# Altium schematic sheet AFE.SchDoc: FIT_PM12 board
size 420 x 297 mm; CheckedBy: G.Kasprowicz; Author: INR Moscow; CompanyName: WUT ISE; DrawnBy: M.Podgórski; Organization: WUT ISE; Address1: PW ISE; Address2: Nowowiejska 15/19 00-665 Warsaw; Address3: gkasprow@gmail.com; DocumentNumber: 2; Revision: 2; SheetNumber: 4; SheetTotal: 21; ModifiedBy: -; CheckedDate: -; Title2: AFEs; DivGrp: WUT ISE; Designer: INR RAS; ModifiedDate: -; ProjectName: Sensor Box
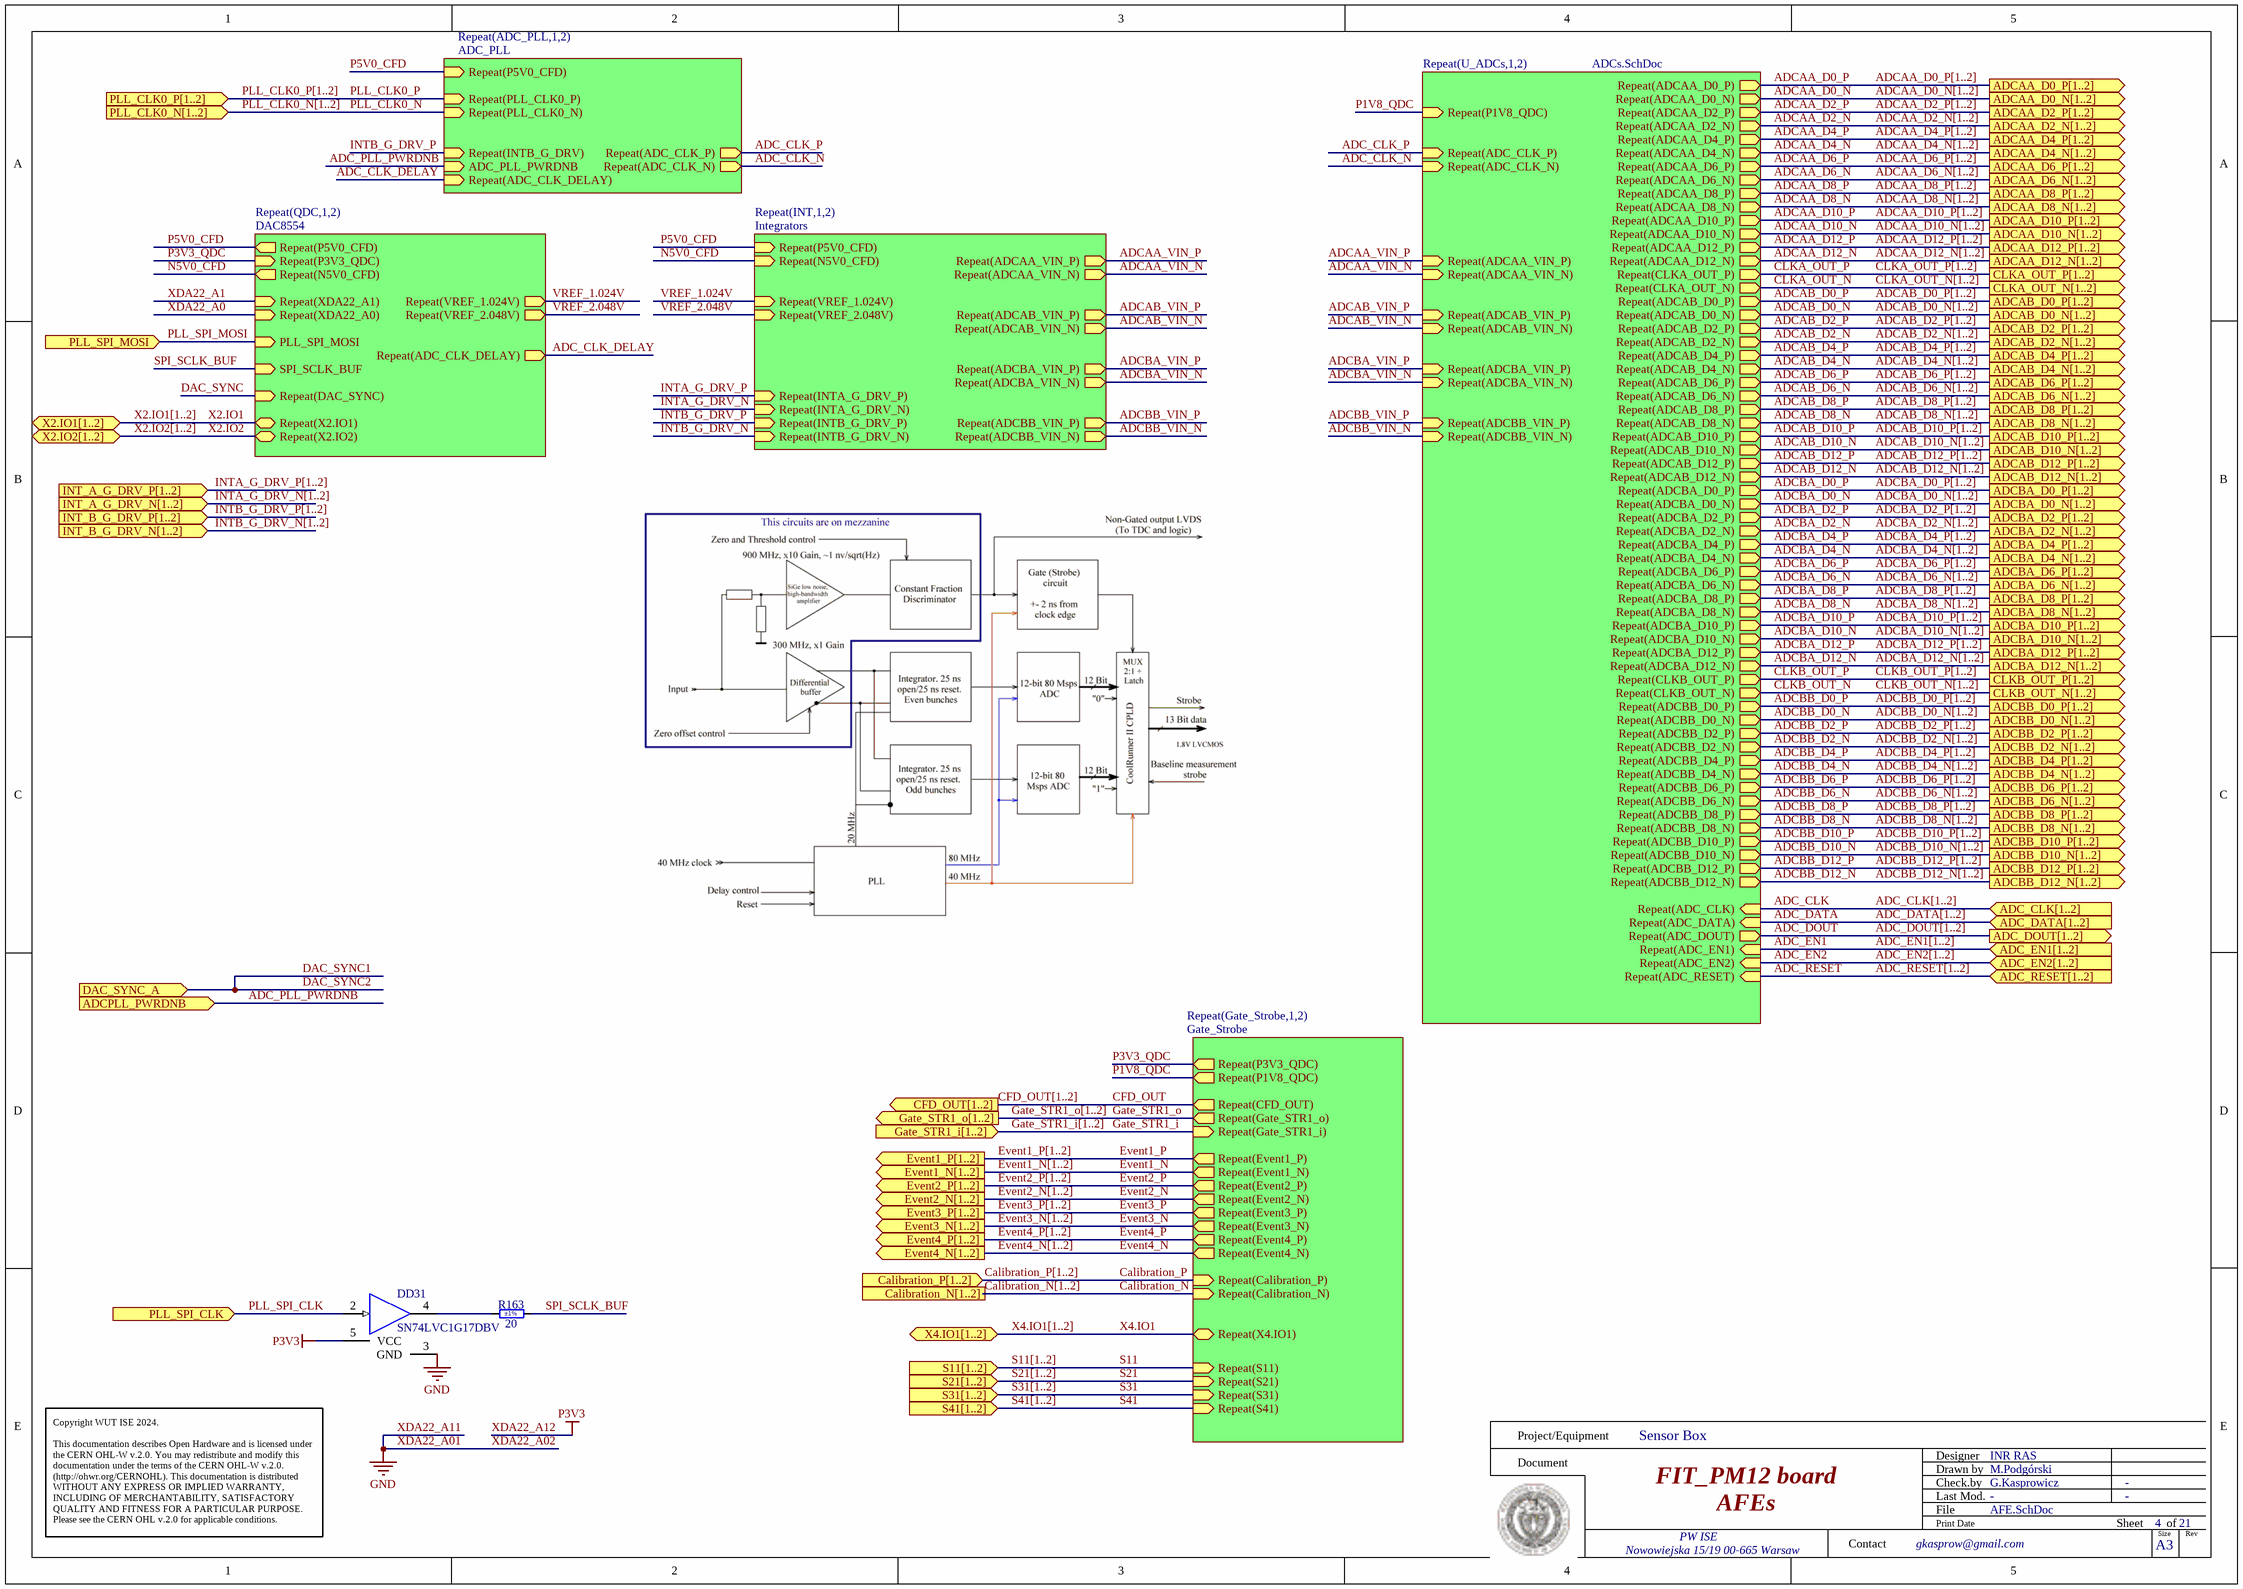
[diagram p0: AFE.SchDoc]

## Parts
DD31  SN74LVC1G17DBV  [SOT95P280X145-5N]
R163  20  Tolerance: ±1%  [RESC2012X60N]

## Sub-sheets
Repeat(ADC_PLL,1,2) = ADC_PLL: ADC_PLL_PWRDNB (in), Repeat(ADC_CLK_DELAY) (in), Repeat(P5V0_CFD) (in), Repeat(INTB_G_DRV) (in), Repeat(PLL_CLK0_P) (in), Repeat(PLL_CLK0_N) (in), Repeat(ADC_CLK_P) (out), Repeat(ADC_CLK_N) (out)
Repeat(Gate_Strobe,1,2) = Gate_Strobe: Repeat(Gate_STR1_i) (in), Repeat(Event1_P) (out), Repeat(Event1_N) (out), Repeat(P3V3_QDC) (out), Repeat(Gate_STR1_o) (out), Repeat(CFD_OUT) (out), Repeat(P1V8_QDC) (out), Repeat(X4.IO1) (bidir), Repeat(Event2_P) (out), Repeat(Event2_N) (out), Repeat(Event3_P) (out), Repeat(Event3_N) (out), Repeat(Event4_P) (out), Repeat(Event4_N) (out), Repeat(Calibration_P) (in), Repeat(Calibration_N) (in), Repeat(S11) (in), Repeat(S21) (in), Repeat(S31) (in), Repeat(S41) (in)
Repeat(INT,1,2) = Integrators: Repeat(N5V0_CFD) (in), Repeat(P5V0_CFD) (in), Repeat(INTA_G_DRV_N) (in), Repeat(INTB_G_DRV_P) (in), Repeat(VREF_2.048V) (in), Repeat(VREF_1.024V) (in), Repeat(ADCAA_VIN_P) (out), Repeat(ADCAA_VIN_N) (out), Repeat(ADCAB_VIN_P) (out), Repeat(ADCAB_VIN_N) (out), Repeat(ADCBA_VIN_P) (out), Repeat(ADCBA_VIN_N) (out), Repeat(ADCBB_VIN_P) (out), Repeat(ADCBB_VIN_N) (out), Repeat(INTB_G_DRV_N) (in), Repeat(INTA_G_DRV_P) (in)
Repeat(QDC,1,2) = DAC8554: Repeat(ADC_CLK_DELAY) (out), PLL_SPI_MOSI (in), SPI_SCLK_BUF (in), Repeat(DAC_SYNC) (in), Repeat(P5V0_CFD) (out), Repeat(N5V0_CFD) (out), Repeat(P3V3_QDC) (in), Repeat(VREF_2.048V) (out), Repeat(VREF_1.024V) (out), Repeat(XDA22_A1) (in), Repeat(XDA22_A0) (in), Repeat(X2.IO1) (bidir), Repeat(X2.IO2) (bidir)
Repeat(U_ADCs,1,2) = ADCs.SchDoc: Repeat(ADCAA_VIN_P) (in), Repeat(ADCAA_VIN_N) (in), Repeat(ADCAB_VIN_P) (in), Repeat(ADCAB_VIN_N) (in), Repeat(ADCBA_VIN_P) (in), Repeat(ADCBA_VIN_N) (in), Repeat(ADCBB_VIN_P) (in), Repeat(ADCBB_VIN_N) (in), Repeat(P1V8_QDC) (in), Repeat(ADCAA_D0_P) (out), Repeat(ADCAA_D0_N) (out), Repeat(ADCAA_D2_P) (out), Repeat(ADCAA_D2_N) (out), Repeat(ADCAA_D4_P) (out), Repeat(ADCAA_D4_N) (out), Repeat(ADCAA_D6_P) (out), Repeat(ADCAA_D6_N) (out), Repeat(ADCAA_D8_P) (out), Repeat(ADCAA_D8_N) (out), Repeat(ADCAA_D10_P) (out), Repeat(ADCAA_D10_N) (out), Repeat(ADCAA_D12_P) (out), Repeat(ADCAA_D12_N) (out), Repeat(CLKA_OUT_P) (out), Repeat(CLKA_OUT_N) (out), Repeat(ADCAB_D0_P) (out), Repeat(ADCAB_D0_N) (out), Repeat(ADCAB_D2_P) (out), Repeat(ADCAB_D2_N) (out), Repeat(ADCAB_D4_P) (out), Repeat(ADCAB_D4_N) (out), Repeat(ADCAB_D6_P) (out), Repeat(ADCAB_D6_N) (out), Repeat(ADCAB_D8_P) (out), Repeat(ADCAB_D8_N) (out), Repeat(ADCAB_D10_P) (out), Repeat(ADCAB_D10_N) (out), Repeat(ADCAB_D12_P) (out), Repeat(ADCAB_D12_N) (out), Repeat(ADCBA_D0_P) (out), Repeat(ADCBA_D0_N) (out), Repeat(ADCBA_D2_P) (out), Repeat(ADCBA_D2_N) (out), Repeat(ADCBA_D4_P) (out), Repeat(ADCBA_D4_N) (out), Repeat(ADCBA_D6_P) (out), Repeat(ADCBA_D6_N) (out), Repeat(ADCBA_D8_P) (out), Repeat(ADCBA_D8_N) (out), Repeat(ADCBA_D10_P) (out), Repeat(ADCBA_D10_N) (out), Repeat(ADCBA_D12_P) (out), Repeat(ADCBA_D12_N) (out), Repeat(CLKB_OUT_P) (out), Repeat(CLKB_OUT_N) (out), Repeat(ADCBB_D0_P) (out), Repeat(ADCBB_D0_N) (out), Repeat(ADCBB_D2_P) (out), Repeat(ADCBB_D2_N) (out), Repeat(ADCBB_D4_P) (out), Repeat(ADCBB_D4_N) (out), Repeat(ADCBB_D6_P) (out), Repeat(ADCBB_D6_N) (out), Repeat(ADCBB_D8_P) (out), Repeat(ADCBB_D8_N) (out), Repeat(ADCBB_D10_P) (out), Repeat(ADCBB_D10_N) (out), Repeat(ADCBB_D12_P) (out), Repeat(ADCBB_D12_N) (out), Repeat(ADC_CLK_N) (in), Repeat(ADC_CLK_P) (in), Repeat(ADC_CLK) (in), Repeat(ADC_DATA) (in), Repeat(ADC_DOUT) (out), Repeat(ADC_EN1) (in), Repeat(ADC_EN2) (in), Repeat(ADC_RESET) (in)

## Ports
ADC_CLK[1..2] (in), ADC_DATA[1..2] (in), ADC_DOUT[1..2] (out), ADC_EN1[1..2] (in), ADC_EN2[1..2] (in), ADC_RESET[1..2] (in), ADCAA_D0_N[1..2] (out), ADCAA_D0_P[1..2] (out), ADCAA_D2_N[1..2] (out), ADCAA_D2_P[1..2] (out), ADCAA_D4_N[1..2] (out), ADCAA_D4_P[1..2] (out), ADCAA_D6_N[1..2] (out), ADCAA_D6_P[1..2] (out), ADCAA_D8_N[1..2] (out), ADCAA_D8_P[1..2] (out), ADCAA_D10_N[1..2] (out), ADCAA_D10_P[1..2] (out), ADCAA_D12_N[1..2] (out), ADCAA_D12_P[1..2] (out), ADCAB_D0_N[1..2] (out), ADCAB_D0_P[1..2] (out), ADCAB_D2_N[1..2] (out), ADCAB_D2_P[1..2] (out), ADCAB_D4_N[1..2] (out), ADCAB_D4_P[1..2] (out), ADCAB_D6_N[1..2] (out), ADCAB_D6_P[1..2] (out), ADCAB_D8_N[1..2] (out), ADCAB_D8_P[1..2] (out), ADCAB_D10_N[1..2] (out), ADCAB_D10_P[1..2] (out), ADCAB_D12_N[1..2] (out), ADCAB_D12_P[1..2] (out), ADCBA_D0_N[1..2] (out), ADCBA_D0_P[1..2] (out), ADCBA_D2_N[1..2] (out), ADCBA_D2_P[1..2] (out), ADCBA_D4_N[1..2] (out), ADCBA_D4_P[1..2] (out), ADCBA_D6_N[1..2] (out), ADCBA_D6_P[1..2] (out), ADCBA_D8_N[1..2] (out), ADCBA_D8_P[1..2] (out), ADCBA_D10_N[1..2] (out), ADCBA_D10_P[1..2] (out), ADCBA_D12_N[1..2] (out), ADCBA_D12_P[1..2] (out), ADCBB_D0_N[1..2] (out), ADCBB_D0_P[1..2] (out), ADCBB_D2_N[1..2] (out), ADCBB_D2_P[1..2] (out), ADCBB_D4_N[1..2] (out), ADCBB_D4_P[1..2] (out), ADCBB_D6_N[1..2] (out), ADCBB_D6_P[1..2] (out), ADCBB_D8_N[1..2] (out), ADCBB_D8_P[1..2] (out), ADCBB_D10_N[1..2] (out), ADCBB_D10_P[1..2] (out), ADCBB_D12_N[1..2] (out), ADCBB_D12_P[1..2] (out), ADCPLL_PWRDNB (in), Calibration_N[1..2] (in), Calibration_P[1..2] (in), CFD_OUT[1..2] (out), CLKA_OUT_N[1..2] (out), CLKA_OUT_P[1..2] (out), CLKB_OUT_N[1..2] (out), CLKB_OUT_P[1..2] (out), DAC_SYNC_A (in), Event1_N[1..2] (out), Event1_P[1..2] (out), Event2_N[1..2] (out), Event2_P[1..2] (out), Event3_N[1..2] (out), Event3_P[1..2] (out), Event4_N[1..2] (out), Event4_P[1..2] (out), Gate_STR1_i[1..2] (in), Gate_STR1_o[1..2] (out), INT_A_G_DRV_N[1..2] (in), INT_A_G_DRV_P[1..2] (in), INT_B_G_DRV_N[1..2] (in), INT_B_G_DRV_P[1..2] (in), PLL_CLK0_N[1..2] (in), PLL_CLK0_P[1..2] (in), PLL_SPI_CLK (in), PLL_SPI_MOSI (in), S11[1..2] (in), S21[1..2] (in), S31[1..2] (in), S41[1..2] (in), X2.IO1[1..2] (bidir), X2.IO2[1..2] (bidir), X4.IO1[1..2] (bidir)

## Nets
XDA22_A01: DD31.3(GND)  [also labelled GND, XDA22_A02, XDA22_A11]
XDA22_A12: DD31.5(VCC)  [also labelled P3V3]
ADC_CLK: sheet Repeat(U_ADCs,1,2)/Repeat(ADC_CLK)
ADC_CLK_DELAY: sheet Repeat(QDC,1,2)/Repeat(ADC_CLK_DELAY), sheet Repeat(ADC_PLL,1,2)/Repeat(ADC_CLK_DELAY)
ADC_CLK_N: sheet Repeat(ADC_PLL,1,2)/Repeat(ADC_CLK_N), sheet Repeat(U_ADCs,1,2)/Repeat(ADC_CLK_N)
ADC_CLK_P: sheet Repeat(ADC_PLL,1,2)/Repeat(ADC_CLK_P), sheet Repeat(U_ADCs,1,2)/Repeat(ADC_CLK_P)
ADC_DATA: sheet Repeat(U_ADCs,1,2)/Repeat(ADC_DATA)
ADC_DOUT: sheet Repeat(U_ADCs,1,2)/Repeat(ADC_DOUT)
ADC_EN1: sheet Repeat(U_ADCs,1,2)/Repeat(ADC_EN1)
ADC_EN2: sheet Repeat(U_ADCs,1,2)/Repeat(ADC_EN2)
ADC_PLL_PWRDNB: port ADCPLL_PWRDNB, sheet Repeat(ADC_PLL,1,2)/ADC_PLL_PWRDNB
ADC_RESET: sheet Repeat(U_ADCs,1,2)/Repeat(ADC_RESET)
ADCAA_D0_N: sheet Repeat(U_ADCs,1,2)/Repeat(ADCAA_D0_N)
ADCAA_D0_P: sheet Repeat(U_ADCs,1,2)/Repeat(ADCAA_D0_P)
ADCAA_D2_N: sheet Repeat(U_ADCs,1,2)/Repeat(ADCAA_D2_N)
ADCAA_D2_P: sheet Repeat(U_ADCs,1,2)/Repeat(ADCAA_D2_P)
ADCAA_D4_N: sheet Repeat(U_ADCs,1,2)/Repeat(ADCAA_D4_N)
ADCAA_D4_P: sheet Repeat(U_ADCs,1,2)/Repeat(ADCAA_D4_P)
ADCAA_D6_N: sheet Repeat(U_ADCs,1,2)/Repeat(ADCAA_D6_N)
ADCAA_D6_P: sheet Repeat(U_ADCs,1,2)/Repeat(ADCAA_D6_P)
ADCAA_D8_N: sheet Repeat(U_ADCs,1,2)/Repeat(ADCAA_D8_N)
ADCAA_D8_P: sheet Repeat(U_ADCs,1,2)/Repeat(ADCAA_D8_P)
ADCAA_D10_N: sheet Repeat(U_ADCs,1,2)/Repeat(ADCAA_D10_N)
ADCAA_D10_P: sheet Repeat(U_ADCs,1,2)/Repeat(ADCAA_D10_P)
ADCAA_D12_N: sheet Repeat(U_ADCs,1,2)/Repeat(ADCAA_D12_N)
ADCAA_D12_P: sheet Repeat(U_ADCs,1,2)/Repeat(ADCAA_D12_P)
ADCAA_VIN_N: sheet Repeat(INT,1,2)/Repeat(ADCAA_VIN_N), sheet Repeat(U_ADCs,1,2)/Repeat(ADCAA_VIN_N)
ADCAA_VIN_P: sheet Repeat(INT,1,2)/Repeat(ADCAA_VIN_P), sheet Repeat(U_ADCs,1,2)/Repeat(ADCAA_VIN_P)
ADCAB_D0_N: sheet Repeat(U_ADCs,1,2)/Repeat(ADCAB_D0_N)
ADCAB_D0_P: sheet Repeat(U_ADCs,1,2)/Repeat(ADCAB_D0_P)
ADCAB_D2_N: sheet Repeat(U_ADCs,1,2)/Repeat(ADCAB_D2_N)
ADCAB_D2_P: sheet Repeat(U_ADCs,1,2)/Repeat(ADCAB_D2_P)
ADCAB_D4_N: sheet Repeat(U_ADCs,1,2)/Repeat(ADCAB_D4_N)
ADCAB_D4_P: sheet Repeat(U_ADCs,1,2)/Repeat(ADCAB_D4_P)
ADCAB_D6_N: sheet Repeat(U_ADCs,1,2)/Repeat(ADCAB_D6_N)
ADCAB_D6_P: sheet Repeat(U_ADCs,1,2)/Repeat(ADCAB_D6_P)
ADCAB_D8_N: sheet Repeat(U_ADCs,1,2)/Repeat(ADCAB_D8_N)
ADCAB_D8_P: sheet Repeat(U_ADCs,1,2)/Repeat(ADCAB_D8_P)
ADCAB_D10_N: sheet Repeat(U_ADCs,1,2)/Repeat(ADCAB_D10_N)
ADCAB_D10_P: sheet Repeat(U_ADCs,1,2)/Repeat(ADCAB_D10_P)
ADCAB_D12_N: sheet Repeat(U_ADCs,1,2)/Repeat(ADCAB_D12_N)
ADCAB_D12_P: sheet Repeat(U_ADCs,1,2)/Repeat(ADCAB_D12_P)
ADCAB_VIN_N: sheet Repeat(INT,1,2)/Repeat(ADCAB_VIN_N), sheet Repeat(U_ADCs,1,2)/Repeat(ADCAB_VIN_N)
ADCAB_VIN_P: sheet Repeat(INT,1,2)/Repeat(ADCAB_VIN_P), sheet Repeat(U_ADCs,1,2)/Repeat(ADCAB_VIN_P)
ADCBA_D0_N: sheet Repeat(U_ADCs,1,2)/Repeat(ADCBA_D0_N)
ADCBA_D0_P: sheet Repeat(U_ADCs,1,2)/Repeat(ADCBA_D0_P)
ADCBA_D2_N: sheet Repeat(U_ADCs,1,2)/Repeat(ADCBA_D2_N)
ADCBA_D2_P: sheet Repeat(U_ADCs,1,2)/Repeat(ADCBA_D2_P)
ADCBA_D4_N: sheet Repeat(U_ADCs,1,2)/Repeat(ADCBA_D4_N)
ADCBA_D4_P: sheet Repeat(U_ADCs,1,2)/Repeat(ADCBA_D4_P)
ADCBA_D6_N: sheet Repeat(U_ADCs,1,2)/Repeat(ADCBA_D6_N)
ADCBA_D6_P: sheet Repeat(U_ADCs,1,2)/Repeat(ADCBA_D6_P)
ADCBA_D8_N: sheet Repeat(U_ADCs,1,2)/Repeat(ADCBA_D8_N)
ADCBA_D8_P: sheet Repeat(U_ADCs,1,2)/Repeat(ADCBA_D8_P)
ADCBA_D10_N: sheet Repeat(U_ADCs,1,2)/Repeat(ADCBA_D10_N)
ADCBA_D10_P: sheet Repeat(U_ADCs,1,2)/Repeat(ADCBA_D10_P)
ADCBA_D12_N: sheet Repeat(U_ADCs,1,2)/Repeat(ADCBA_D12_N)
ADCBA_D12_P: sheet Repeat(U_ADCs,1,2)/Repeat(ADCBA_D12_P)
ADCBA_VIN_N: sheet Repeat(INT,1,2)/Repeat(ADCBA_VIN_N), sheet Repeat(U_ADCs,1,2)/Repeat(ADCBA_VIN_N)
ADCBA_VIN_P: sheet Repeat(INT,1,2)/Repeat(ADCBA_VIN_P), sheet Repeat(U_ADCs,1,2)/Repeat(ADCBA_VIN_P)
ADCBB_D0_N: sheet Repeat(U_ADCs,1,2)/Repeat(ADCBB_D0_N)
ADCBB_D0_P: sheet Repeat(U_ADCs,1,2)/Repeat(ADCBB_D0_P)
ADCBB_D2_N: sheet Repeat(U_ADCs,1,2)/Repeat(ADCBB_D2_N)
ADCBB_D2_P: sheet Repeat(U_ADCs,1,2)/Repeat(ADCBB_D2_P)
ADCBB_D4_N: sheet Repeat(U_ADCs,1,2)/Repeat(ADCBB_D4_N)
ADCBB_D4_P: sheet Repeat(U_ADCs,1,2)/Repeat(ADCBB_D4_P)
ADCBB_D6_N: sheet Repeat(U_ADCs,1,2)/Repeat(ADCBB_D6_N)
ADCBB_D6_P: sheet Repeat(U_ADCs,1,2)/Repeat(ADCBB_D6_P)
ADCBB_D8_N: sheet Repeat(U_ADCs,1,2)/Repeat(ADCBB_D8_N)
ADCBB_D8_P: sheet Repeat(U_ADCs,1,2)/Repeat(ADCBB_D8_P)
ADCBB_D10_N: sheet Repeat(U_ADCs,1,2)/Repeat(ADCBB_D10_N)
ADCBB_D10_P: sheet Repeat(U_ADCs,1,2)/Repeat(ADCBB_D10_P)
ADCBB_D12_N: sheet Repeat(U_ADCs,1,2)/Repeat(ADCBB_D12_N)
ADCBB_D12_P: sheet Repeat(U_ADCs,1,2)/Repeat(ADCBB_D12_P)
ADCBB_VIN_N: sheet Repeat(INT,1,2)/Repeat(ADCBB_VIN_N), sheet Repeat(U_ADCs,1,2)/Repeat(ADCBB_VIN_N)
ADCBB_VIN_P: sheet Repeat(INT,1,2)/Repeat(ADCBB_VIN_P), sheet Repeat(U_ADCs,1,2)/Repeat(ADCBB_VIN_P)
Calibration_N: sheet Repeat(Gate_Strobe,1,2)/Repeat(Calibration_N)
Calibration_P: sheet Repeat(Gate_Strobe,1,2)/Repeat(Calibration_P)
CFD_OUT: sheet Repeat(Gate_Strobe,1,2)/Repeat(CFD_OUT)
CLKA_OUT_N: sheet Repeat(U_ADCs,1,2)/Repeat(CLKA_OUT_N)
CLKA_OUT_P: sheet Repeat(U_ADCs,1,2)/Repeat(CLKA_OUT_P)
CLKB_OUT_N: sheet Repeat(U_ADCs,1,2)/Repeat(CLKB_OUT_N)
CLKB_OUT_P: sheet Repeat(U_ADCs,1,2)/Repeat(CLKB_OUT_P)
DAC_SYNC: sheet Repeat(QDC,1,2)/Repeat(DAC_SYNC)
DAC_SYNC1: port DAC_SYNC_A  [also labelled DAC_SYNC2]
Event1_N: sheet Repeat(Gate_Strobe,1,2)/Repeat(Event1_N)
Event1_P: sheet Repeat(Gate_Strobe,1,2)/Repeat(Event1_P)
Event2_N: sheet Repeat(Gate_Strobe,1,2)/Repeat(Event2_N)
Event2_P: sheet Repeat(Gate_Strobe,1,2)/Repeat(Event2_P)
Event3_N: sheet Repeat(Gate_Strobe,1,2)/Repeat(Event3_N)
Event3_P: sheet Repeat(Gate_Strobe,1,2)/Repeat(Event3_P)
Event4_N: sheet Repeat(Gate_Strobe,1,2)/Repeat(Event4_N)
Event4_P: sheet Repeat(Gate_Strobe,1,2)/Repeat(Event4_P)
Gate_STR1_i: sheet Repeat(Gate_Strobe,1,2)/Repeat(Gate_STR1_i)
Gate_STR1_o: sheet Repeat(Gate_Strobe,1,2)/Repeat(Gate_STR1_o)
INTA_G_DRV_N: sheet Repeat(INT,1,2)/Repeat(INTA_G_DRV_N)
INTA_G_DRV_P: sheet Repeat(INT,1,2)/Repeat(INTA_G_DRV_P)
INTB_G_DRV_N: sheet Repeat(INT,1,2)/Repeat(INTB_G_DRV_N)
INTB_G_DRV_P: sheet Repeat(INT,1,2)/Repeat(INTB_G_DRV_P), sheet Repeat(ADC_PLL,1,2)/Repeat(INTB_G_DRV)
N5V0_CFD: sheet Repeat(INT,1,2)/Repeat(N5V0_CFD), sheet Repeat(QDC,1,2)/Repeat(N5V0_CFD)
P1V8_QDC: sheet Repeat(Gate_Strobe,1,2)/Repeat(P1V8_QDC), sheet Repeat(U_ADCs,1,2)/Repeat(P1V8_QDC)
P3V3_QDC: sheet Repeat(QDC,1,2)/Repeat(P3V3_QDC), sheet Repeat(Gate_Strobe,1,2)/Repeat(P3V3_QDC)
P5V0_CFD: sheet Repeat(INT,1,2)/Repeat(P5V0_CFD), sheet Repeat(QDC,1,2)/Repeat(P5V0_CFD), sheet Repeat(ADC_PLL,1,2)/Repeat(P5V0_CFD)
PLL_CLK0_N: sheet Repeat(ADC_PLL,1,2)/Repeat(PLL_CLK0_N)
PLL_CLK0_P: sheet Repeat(ADC_PLL,1,2)/Repeat(PLL_CLK0_P)
PLL_SPI_CLK: DD31.2(IN) ; port PLL_SPI_CLK
PLL_SPI_MOSI: port PLL_SPI_MOSI, sheet Repeat(QDC,1,2)/PLL_SPI_MOSI
S11: sheet Repeat(Gate_Strobe,1,2)/Repeat(S11)
S21: sheet Repeat(Gate_Strobe,1,2)/Repeat(S21)
S31: sheet Repeat(Gate_Strobe,1,2)/Repeat(S31)
S41: sheet Repeat(Gate_Strobe,1,2)/Repeat(S41)
SPI_SCLK_BUF: R163.2 ; sheet Repeat(QDC,1,2)/SPI_SCLK_BUF
VREF_1.024V: sheet Repeat(INT,1,2)/Repeat(VREF_1.024V), sheet Repeat(QDC,1,2)/Repeat(VREF_1.024V)
VREF_2.048V: sheet Repeat(INT,1,2)/Repeat(VREF_2.048V), sheet Repeat(QDC,1,2)/Repeat(VREF_2.048V)
X2.IO1: sheet Repeat(QDC,1,2)/Repeat(X2.IO1)
X2.IO2: sheet Repeat(QDC,1,2)/Repeat(X2.IO2)
X4.IO1: sheet Repeat(Gate_Strobe,1,2)/Repeat(X4.IO1)
XDA22_A0: sheet Repeat(QDC,1,2)/Repeat(XDA22_A0)
XDA22_A1: sheet Repeat(QDC,1,2)/Repeat(XDA22_A1)
NetDD31_4: DD31.4(OUT) R163.1

## Buses and harness runs
bus ADC_CLK[1..2] = port ADC_CLK[1..2]
bus ADC_DATA[1..2] = port ADC_DATA[1..2]
bus ADC_DOUT[1..2] = port ADC_DOUT[1..2]
bus ADC_EN1[1..2] = port ADC_EN1[1..2]
bus ADC_EN2[1..2] = port ADC_EN2[1..2]
bus ADC_RESET[1..2] = port ADC_RESET[1..2]
bus ADCAA_D0_N[1..2] = port ADCAA_D0_N[1..2]
bus ADCAA_D0_P[1..2] = port ADCAA_D0_P[1..2]
bus ADCAA_D2_N[1..2] = port ADCAA_D2_N[1..2]
bus ADCAA_D2_P[1..2] = port ADCAA_D2_P[1..2]
bus ADCAA_D4_N[1..2] = port ADCAA_D4_N[1..2]
bus ADCAA_D4_P[1..2] = port ADCAA_D4_P[1..2]
bus ADCAA_D6_N[1..2] = port ADCAA_D6_N[1..2]
bus ADCAA_D6_P[1..2] = port ADCAA_D6_P[1..2]
bus ADCAA_D8_N[1..2] = port ADCAA_D8_N[1..2]
bus ADCAA_D8_P[1..2] = port ADCAA_D8_P[1..2]
bus ADCAA_D10_N[1..2] = port ADCAA_D10_N[1..2]
bus ADCAA_D10_P[1..2] = port ADCAA_D10_P[1..2]
bus ADCAA_D12_N[1..2] = port ADCAA_D12_N[1..2]
bus ADCAA_D12_P[1..2] = port ADCAA_D12_P[1..2]
bus ADCAB_D0_N[1..2] = port ADCAB_D0_N[1..2]
bus ADCAB_D0_P[1..2] = port ADCAB_D0_P[1..2]
bus ADCAB_D2_N[1..2] = port ADCAB_D2_N[1..2]
bus ADCAB_D2_P[1..2] = port ADCAB_D2_P[1..2]
bus ADCAB_D4_N[1..2] = port ADCAB_D4_N[1..2]
bus ADCAB_D4_P[1..2] = port ADCAB_D4_P[1..2]
bus ADCAB_D6_N[1..2] = port ADCAB_D6_N[1..2]
bus ADCAB_D6_P[1..2] = port ADCAB_D6_P[1..2]
bus ADCAB_D8_N[1..2] = port ADCAB_D8_N[1..2]
bus ADCAB_D8_P[1..2] = port ADCAB_D8_P[1..2]
bus ADCAB_D10_N[1..2] = port ADCAB_D10_N[1..2]
bus ADCAB_D10_P[1..2] = port ADCAB_D10_P[1..2]
bus ADCAB_D12_N[1..2] = port ADCAB_D12_N[1..2]
bus ADCAB_D12_P[1..2] = port ADCAB_D12_P[1..2]
bus ADCBA_D0_N[1..2] = port ADCBA_D0_N[1..2]
bus ADCBA_D0_P[1..2] = port ADCBA_D0_P[1..2]
bus ADCBA_D2_N[1..2] = port ADCBA_D2_N[1..2]
bus ADCBA_D2_P[1..2] = port ADCBA_D2_P[1..2]
bus ADCBA_D4_N[1..2] = port ADCBA_D4_N[1..2]
bus ADCBA_D4_P[1..2] = port ADCBA_D4_P[1..2]
bus ADCBA_D6_N[1..2] = port ADCBA_D6_N[1..2]
bus ADCBA_D6_P[1..2] = port ADCBA_D6_P[1..2]
bus ADCBA_D8_N[1..2] = port ADCBA_D8_N[1..2]
bus ADCBA_D8_P[1..2] = port ADCBA_D8_P[1..2]
bus ADCBA_D10_N[1..2] = port ADCBA_D10_N[1..2]
bus ADCBA_D10_P[1..2] = port ADCBA_D10_P[1..2]
bus ADCBA_D12_N[1..2] = port ADCBA_D12_N[1..2]
bus ADCBA_D12_P[1..2] = port ADCBA_D12_P[1..2]
bus ADCBB_D0_N[1..2] = port ADCBB_D0_N[1..2]
bus ADCBB_D0_P[1..2] = port ADCBB_D0_P[1..2]
bus ADCBB_D2_N[1..2] = port ADCBB_D2_N[1..2]
bus ADCBB_D2_P[1..2] = port ADCBB_D2_P[1..2]
bus ADCBB_D4_N[1..2] = port ADCBB_D4_N[1..2]
bus ADCBB_D4_P[1..2] = port ADCBB_D4_P[1..2]
bus ADCBB_D6_N[1..2] = port ADCBB_D6_N[1..2]
bus ADCBB_D6_P[1..2] = port ADCBB_D6_P[1..2]
bus ADCBB_D8_N[1..2] = port ADCBB_D8_N[1..2]
bus ADCBB_D8_P[1..2] = port ADCBB_D8_P[1..2]
bus ADCBB_D10_N[1..2] = port ADCBB_D10_N[1..2]
bus ADCBB_D10_P[1..2] = port ADCBB_D10_P[1..2]
bus ADCBB_D12_N[1..2] = port ADCBB_D12_N[1..2]
bus ADCBB_D12_P[1..2] = port ADCBB_D12_P[1..2]
bus Calibration_N[1..2] = port Calibration_N[1..2]
bus Calibration_P[1..2] = port Calibration_P[1..2]
bus CFD_OUT[1..2] = port CFD_OUT[1..2]
bus CLKA_OUT_N[1..2] = port CLKA_OUT_N[1..2]
bus CLKA_OUT_P[1..2] = port CLKA_OUT_P[1..2]
bus CLKB_OUT_N[1..2] = port CLKB_OUT_N[1..2]
bus CLKB_OUT_P[1..2] = port CLKB_OUT_P[1..2]
bus Event1_N[1..2] = port Event1_N[1..2]
bus Event1_P[1..2] = port Event1_P[1..2]
bus Event2_N[1..2] = port Event2_N[1..2]
bus Event2_P[1..2] = port Event2_P[1..2]
bus Event3_N[1..2] = port Event3_N[1..2]
bus Event3_P[1..2] = port Event3_P[1..2]
bus Event4_N[1..2] = port Event4_N[1..2]
bus Event4_P[1..2] = port Event4_P[1..2]
bus Gate_STR1_i[1..2] = port Gate_STR1_i[1..2]
bus Gate_STR1_o[1..2] = port Gate_STR1_o[1..2]
bus INTA_G_DRV_N[1..2] = port INT_A_G_DRV_N[1..2]
bus INTA_G_DRV_P[1..2] = port INT_A_G_DRV_P[1..2]
bus INTB_G_DRV_N[1..2] = port INT_B_G_DRV_N[1..2]
bus INTB_G_DRV_P[1..2] = port INT_B_G_DRV_P[1..2]
bus PLL_CLK0_N[1..2] = port PLL_CLK0_N[1..2]
bus PLL_CLK0_P[1..2] = port PLL_CLK0_P[1..2]
bus S11[1..2] = port S11[1..2]
bus S21[1..2] = port S21[1..2]
bus S31[1..2] = port S31[1..2]
bus S41[1..2] = port S41[1..2]
bus X2.IO1[1..2] = port X2.IO1[1..2]
bus X2.IO2[1..2] = port X2.IO2[1..2]
bus X4.IO1[1..2] = port X4.IO1[1..2]

## Notes on the sheet
- Project/Equipment
- Document
- Designer
- Drawn by
- Check.by
- Copyright WUT ISE 2024.
  This documentation describes Open Hardware and is licensed under the CERN OHL-W v.2.0. You may redistribute and modify this documentation under the terms of the CERN OHL-W v.2.0. (http://ohwr.org/CERNOHL). This documentation is distributed WITHOUT ANY EXPRESS OR IMPLIED WARRANTY, INCLUDING OF MERCHANTABILITY, SATISFACTORY QUALITY AND FITNESS FOR A PARTICULAR PURPOSE. Please see the CERN OHL v.2.0 for applicable conditions.
- Contact
- File
- Last Mod.
- Print Date
- Sheet
- Size
- A3
- of
- Rev

## Library data of the parts
DD31 = SN74LVC1G17DBVR: Single Schmitt-Trigger Buffer; Manufacturer: TEXAS INSTRUMENTS; PressFit: No; Bonding: No; Part Number: SN74LVC1G17DBVR; Component Kind: Standard; Component Type: Standard; Device: SN74LVC1G17DBV; PackageDescription: SOT, 0.95mm Pitch; 5 Pin, 1.60mm W X 2.90mm L X 1.45mm H body, IPC Medium Density; Part Description: Single Schmitt-Trigger Buffer; Manufacturer Part Number: SN74LVC1G17DBV; Pin Count: 5; Case: SOT23-5; Mounted: Yes; Socket: No; SMD: Yes; Sense: No; ComponentHeight: 1.45mm; Author: CERN DEM JLC; HelpURL: \\cern.ch\dfs\Applications\Altium\Datasheets\SN74LVC1G17DBVR.pdf; CreateDate: 06.11.2012; LatestRevisionDate: 06.11.2012
R163 = R0805_20R_1%_0.125W_100PPM: Resistor - 1%; Part Description: General Purpose Thick Film Chip Resistor; Manufacturer: GENERIC; Manufacturer1 Part Number: NRC10F20R0TRF; Power: 0.125W; TC: ±100ppm/°C; PressFit: No; Part Number: R0805_20R_1%_0.125W_100PPM; Component Kind: Standard; Component Type: Standard; Pin Count: 2; Value: 20; Status: Preferred; Manufacturer Part Number: R0805_20R_1%_0.125W_100PPM; Case: 0805; Mounted: Yes; Sense: No; Socket: No; SMD: Yes; Manufacturer1 Example: NIC COMPONENT; Manufacturer1 ComponentHeight: 0.6mm; HelpURL: \\cern.ch\dfs\Applications\Altium\Datasheets\R0805_NIC_NRC.pdf; Author: CERN DEM JLC; CreateDate: 03.12.2007; LatestRevisionDate: 13.03.2008